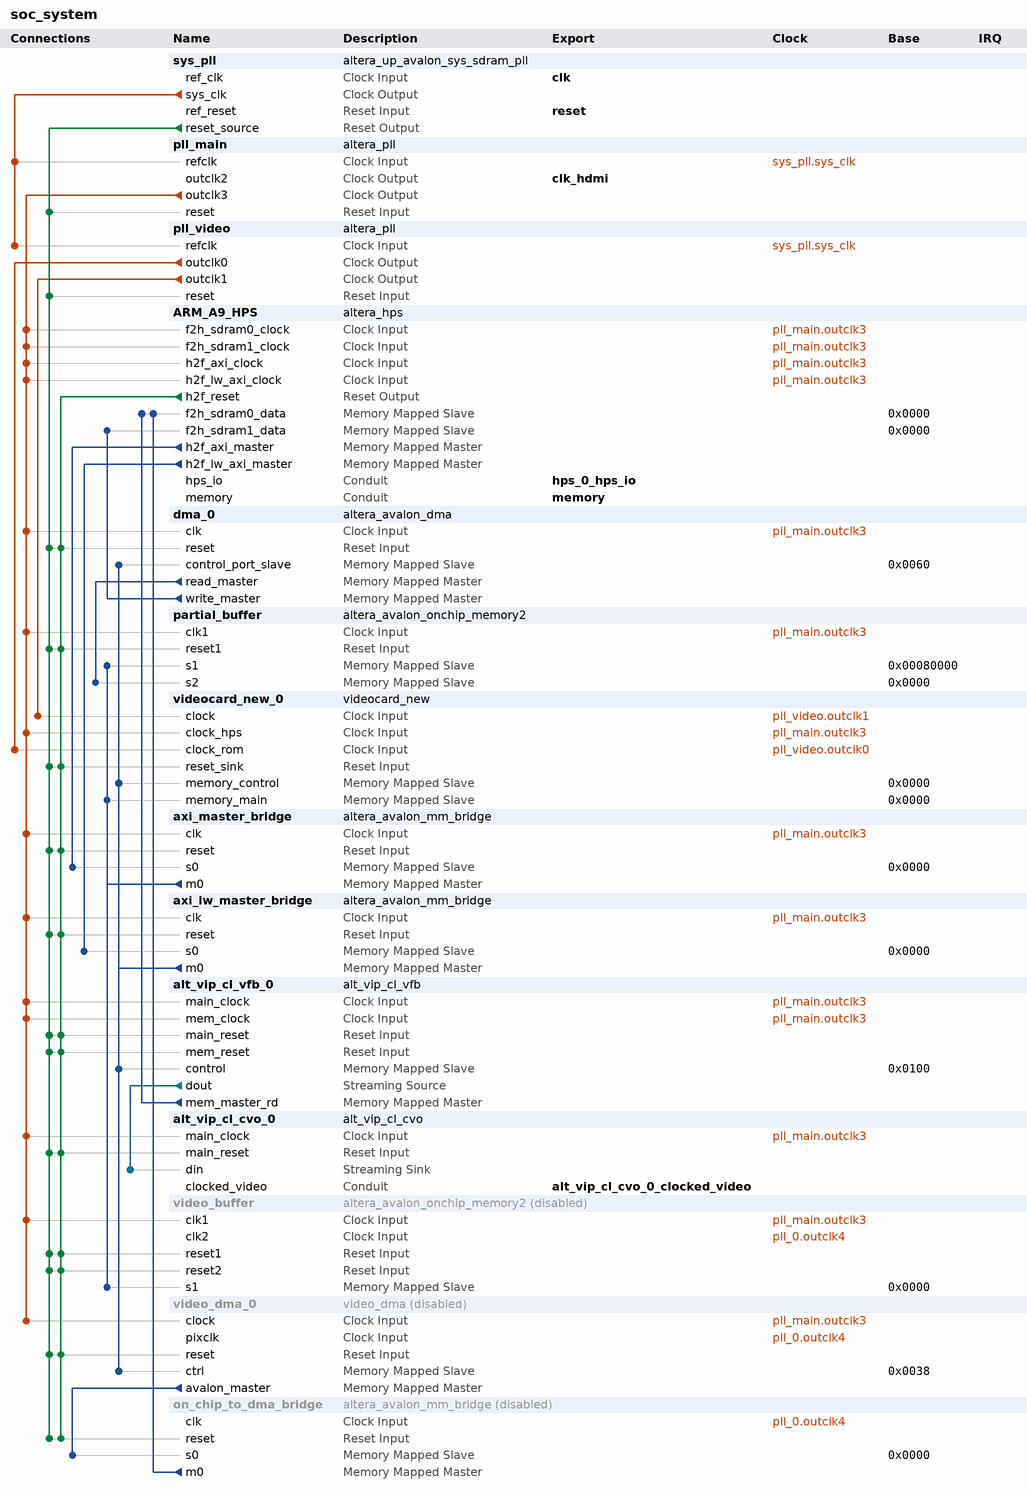
[diagram p0: system contents]
# Platform Designer (Qsys) system soc_system, Cyclone V 5CSEBA6U23I7
# Parameters at their usual value, and those the tool derives, are not listed.
package require -exact qsys 20.1
create_system soc_system
set_project_property DEVICE_FAMILY {Cyclone V}
set_project_property DEVICE 5CSEBA6U23I7

add_instance sys_pll altera_up_avalon_sys_sdram_pll 18.0
set_instance_parameter_value sys_pll CV_boards DE10-Nano
set_instance_parameter_value sys_pll gui_outclk 50.0
set_instance_parameter_value sys_pll gui_refclk 50.0

add_instance pll_main altera_pll 20.1
set_instance_parameter_value pll_main gui_device_speed_grade 1
set_instance_parameter_value pll_main gui_number_of_clocks 4
set_instance_parameter_value pll_main gui_operation_mode direct
set_instance_parameter_value pll_main gui_output_clock_frequency0 10.0
set_instance_parameter_value pll_main gui_output_clock_frequency1 5.0
set_instance_parameter_value pll_main gui_output_clock_frequency2 65.0
set_instance_parameter_value pll_main gui_output_clock_frequency3 100.0
set_instance_parameter_value pll_main gui_pll_mode {Integer-N PLL}
set_instance_parameter_value pll_main gui_reference_clock_frequency 50.0
set_instance_parameter_value pll_main gui_use_locked false

add_instance pll_video altera_pll 20.1
set_instance_parameter_value pll_video gui_device_speed_grade 1
set_instance_parameter_value pll_video gui_number_of_clocks 2
set_instance_parameter_value pll_video gui_operation_mode direct
set_instance_parameter_value pll_video gui_output_clock_frequency0 10.0
set_instance_parameter_value pll_video gui_output_clock_frequency1 1.0
set_instance_parameter_value pll_video gui_pll_mode {Integer-N PLL}
set_instance_parameter_value pll_video gui_reference_clock_frequency 50.0
set_instance_parameter_value pll_video gui_use_locked false

add_instance ARM_A9_HPS altera_hps 20.1
set_instance_parameter_value ARM_A9_HPS EMAC1_Mode RGMII
set_instance_parameter_value ARM_A9_HPS EMAC1_PinMuxing {HPS I/O Set 0}
set_instance_parameter_value ARM_A9_HPS F2SCLK_COLDRST_Enable false
set_instance_parameter_value ARM_A9_HPS F2SCLK_DBGRST_Enable false
set_instance_parameter_value ARM_A9_HPS F2SCLK_WARMRST_Enable false
set_instance_parameter_value ARM_A9_HPS F2SDRAM_Type {Avalon-MM Bidirectional,Avalon-MM Bidirectional}
set_instance_parameter_value ARM_A9_HPS F2SDRAM_Width 128,32
set_instance_parameter_value ARM_A9_HPS F2SINTERRUPT_Enable false
set_instance_parameter_value ARM_A9_HPS F2S_Width 0
set_instance_parameter_value ARM_A9_HPS FPGA_PERIPHERAL_OUTPUT_CLOCK_FREQ_EMAC0_GTX_CLK 100
set_instance_parameter_value ARM_A9_HPS FPGA_PERIPHERAL_OUTPUT_CLOCK_FREQ_EMAC0_MD_CLK 100.0
set_instance_parameter_value ARM_A9_HPS FPGA_PERIPHERAL_OUTPUT_CLOCK_FREQ_EMAC1_GTX_CLK 100
set_instance_parameter_value ARM_A9_HPS FPGA_PERIPHERAL_OUTPUT_CLOCK_FREQ_EMAC1_MD_CLK 100.0
set_instance_parameter_value ARM_A9_HPS HPS_PROTOCOL DDR3
set_instance_parameter_value ARM_A9_HPS I2C0_Mode I2C
set_instance_parameter_value ARM_A9_HPS I2C0_PinMuxing {HPS I/O Set 0}
set_instance_parameter_value ARM_A9_HPS I2C1_Mode I2C
set_instance_parameter_value ARM_A9_HPS I2C1_PinMuxing {HPS I/O Set 0}
set_instance_parameter_value ARM_A9_HPS LWH2F_Enable true
set_instance_parameter_value ARM_A9_HPS MEM_BANKADDR_WIDTH 3
set_instance_parameter_value ARM_A9_HPS MEM_CLK_FREQ 400.0
set_instance_parameter_value ARM_A9_HPS MEM_COL_ADDR_WIDTH 10
set_instance_parameter_value ARM_A9_HPS MEM_DQ_WIDTH 32
set_instance_parameter_value ARM_A9_HPS MEM_DRV_STR RZQ/6
set_instance_parameter_value ARM_A9_HPS MEM_ROW_ADDR_WIDTH 15
set_instance_parameter_value ARM_A9_HPS MEM_RTT_NOM RZQ/6
set_instance_parameter_value ARM_A9_HPS MEM_RTT_WR {Dynamic ODT off}
set_instance_parameter_value ARM_A9_HPS MEM_TCL 7
set_instance_parameter_value ARM_A9_HPS MEM_TFAW_NS 37.5
set_instance_parameter_value ARM_A9_HPS MEM_TRAS_NS 35.0
set_instance_parameter_value ARM_A9_HPS MEM_TRCD_NS 13.75
set_instance_parameter_value ARM_A9_HPS MEM_TRFC_NS 300.0
set_instance_parameter_value ARM_A9_HPS MEM_TRP_NS 13.75
set_instance_parameter_value ARM_A9_HPS MEM_VENDOR Other
set_instance_parameter_value ARM_A9_HPS MEM_WTCL 7
set_instance_parameter_value ARM_A9_HPS QSPI_Mode N/A
set_instance_parameter_value ARM_A9_HPS QSPI_PinMuxing Unused
set_instance_parameter_value ARM_A9_HPS REF_CLK_FREQ 25.0
set_instance_parameter_value ARM_A9_HPS S2FCLK_USER2CLK 4
set_instance_parameter_value ARM_A9_HPS S2F_Width 3
set_instance_parameter_value ARM_A9_HPS SDIO_Mode {4-bit Data}
set_instance_parameter_value ARM_A9_HPS SDIO_PinMuxing {HPS I/O Set 0}
set_instance_parameter_value ARM_A9_HPS SPIM1_Mode {Single Slave Select}
set_instance_parameter_value ARM_A9_HPS SPIM1_PinMuxing {HPS I/O Set 0}
set_instance_parameter_value ARM_A9_HPS STM_Enable false
set_instance_parameter_value ARM_A9_HPS TIMING_BOARD_AC_SKEW 0.02
set_instance_parameter_value ARM_A9_HPS TIMING_BOARD_AC_TO_CK_SKEW 0.0
set_instance_parameter_value ARM_A9_HPS TIMING_BOARD_DQ_TO_DQS_SKEW 0.0
set_instance_parameter_value ARM_A9_HPS TIMING_BOARD_MAX_CK_DELAY 0.6
set_instance_parameter_value ARM_A9_HPS TIMING_BOARD_MAX_DQS_DELAY 0.6
set_instance_parameter_value ARM_A9_HPS TIMING_BOARD_SKEW_BETWEEN_DQS 0.02
set_instance_parameter_value ARM_A9_HPS TIMING_BOARD_SKEW_CKDQS_DIMM_MAX 0.01
set_instance_parameter_value ARM_A9_HPS TIMING_BOARD_SKEW_CKDQS_DIMM_MIN -0.01
set_instance_parameter_value ARM_A9_HPS TIMING_BOARD_SKEW_WITHIN_DQS 0.02
set_instance_parameter_value ARM_A9_HPS TIMING_TDH 125
set_instance_parameter_value ARM_A9_HPS TIMING_TDQSCK 400
set_instance_parameter_value ARM_A9_HPS TIMING_TDQSQ 120
set_instance_parameter_value ARM_A9_HPS TIMING_TDS 50
set_instance_parameter_value ARM_A9_HPS TIMING_TIH 250
set_instance_parameter_value ARM_A9_HPS TIMING_TIS 175
set_instance_parameter_value ARM_A9_HPS TIMING_TQSH 0.38
set_instance_parameter_value ARM_A9_HPS UART0_Mode {No Flow Control}
set_instance_parameter_value ARM_A9_HPS UART0_PinMuxing {HPS I/O Set 0}
set_instance_parameter_value ARM_A9_HPS USB1_Mode SDR
set_instance_parameter_value ARM_A9_HPS USB1_PinMuxing {HPS I/O Set 0}
set_instance_parameter_value ARM_A9_HPS desired_cfg_clk_mhz 100.0
set_instance_parameter_value ARM_A9_HPS desired_qspi_clk_mhz 370.0

add_instance dma_0 altera_avalon_dma 20.1
set_instance_parameter_value dma_0 allowByteTransactions false
set_instance_parameter_value dma_0 allowDoubleWordTransactions false
set_instance_parameter_value dma_0 allowHalfWordTransactions false
set_instance_parameter_value dma_0 allowQuadWordTransactions false
set_instance_parameter_value dma_0 burstEnable false
set_instance_parameter_value dma_0 fifoDepth 32
set_instance_parameter_value dma_0 maxBurstSize 128
set_instance_parameter_value dma_0 minimumDmaTransactionRegisterWidth 13

add_instance partial_buffer altera_avalon_onchip_memory2 20.1
set_instance_parameter_value partial_buffer dataWidth 32
set_instance_parameter_value partial_buffer dualPort true
set_instance_parameter_value partial_buffer initMemContent true
set_instance_parameter_value partial_buffer initializationFileName onchip_mem.hex
set_instance_parameter_value partial_buffer memorySize 4096
set_instance_parameter_value partial_buffer singleClockOperation true

add_instance videocard_new_0 videocard_new 1.0
set_instance_parameter_value videocard_new_0 BYTES 4
set_instance_parameter_value videocard_new_0 WIDTH 32
set_instance_parameter_value videocard_new_0 WIDTH_CTRL 8

add_instance axi_master_bridge altera_avalon_mm_bridge 20.1
set_instance_parameter_value axi_master_bridge ADDRESS_UNITS SYMBOLS
set_instance_parameter_value axi_master_bridge ADDRESS_WIDTH 10
set_instance_parameter_value axi_master_bridge DATA_WIDTH 32
set_instance_parameter_value axi_master_bridge MAX_PENDING_RESPONSES 4
set_instance_parameter_value axi_master_bridge USE_AUTO_ADDRESS_WIDTH 1

add_instance axi_lw_master_bridge altera_avalon_mm_bridge 20.1
set_instance_parameter_value axi_lw_master_bridge ADDRESS_UNITS SYMBOLS
set_instance_parameter_value axi_lw_master_bridge ADDRESS_WIDTH 10
set_instance_parameter_value axi_lw_master_bridge DATA_WIDTH 32
set_instance_parameter_value axi_lw_master_bridge MAX_PENDING_RESPONSES 4
set_instance_parameter_value axi_lw_master_bridge USE_AUTO_ADDRESS_WIDTH 1

add_instance alt_vip_cl_vfb_0 alt_vip_cl_vfb 20.1
set_instance_parameter_value alt_vip_cl_vfb_0 CLOCKS_ARE_SEPARATE 1
set_instance_parameter_value alt_vip_cl_vfb_0 DROP_FRAMES 1
set_instance_parameter_value alt_vip_cl_vfb_0 DROP_INVALID_FIELDS 1
set_instance_parameter_value alt_vip_cl_vfb_0 DROP_REPEAT_USER 0
set_instance_parameter_value alt_vip_cl_vfb_0 IS_FRAME_READER 1
set_instance_parameter_value alt_vip_cl_vfb_0 LINE_BASED_BUFFERING 0
set_instance_parameter_value alt_vip_cl_vfb_0 MAX_HEIGHT 768
set_instance_parameter_value alt_vip_cl_vfb_0 MAX_WIDTH 1024
set_instance_parameter_value alt_vip_cl_vfb_0 MEM_BASE_ADDR 536870912
set_instance_parameter_value alt_vip_cl_vfb_0 MEM_BUFFER_OFFSET 16777216
set_instance_parameter_value alt_vip_cl_vfb_0 MEM_PORT_WIDTH 128
set_instance_parameter_value alt_vip_cl_vfb_0 NUMBER_OF_COLOR_PLANES 4
set_instance_parameter_value alt_vip_cl_vfb_0 PRIORITIZE_FMAX 0
set_instance_parameter_value alt_vip_cl_vfb_0 READER_RUNTIME_CONTROL 1
set_instance_parameter_value alt_vip_cl_vfb_0 READ_FIFO_DEPTH 512
set_instance_parameter_value alt_vip_cl_vfb_0 USER_PACKETS_MAX_STORAGE 1
set_instance_parameter_value alt_vip_cl_vfb_0 USE_BUFFER_OFFSET 0
set_instance_parameter_value alt_vip_cl_vfb_0 WRITE_BURST_TARGET 32
set_instance_parameter_value alt_vip_cl_vfb_0 WRITE_FIFO_DEPTH 512

add_instance alt_vip_cl_cvo_0 alt_vip_cl_cvo 20.1
set_instance_parameter_value alt_vip_cl_cvo_0 ACCEPT_COLOURS_IN_SEQ 0
set_instance_parameter_value alt_vip_cl_cvo_0 ACCEPT_SYNC 0
set_instance_parameter_value alt_vip_cl_cvo_0 ANC_LINE 0
set_instance_parameter_value alt_vip_cl_cvo_0 AP_LINE 0
set_instance_parameter_value alt_vip_cl_cvo_0 BPS 8
set_instance_parameter_value alt_vip_cl_cvo_0 CLOCKS_ARE_SAME 0
set_instance_parameter_value alt_vip_cl_cvo_0 COLOUR_PLANES_ARE_IN_PARALLEL 1
set_instance_parameter_value alt_vip_cl_cvo_0 CONTEXT_WIDTH 8
set_instance_parameter_value alt_vip_cl_cvo_0 COUNT_STEP_IS_PIP_VALUE 0
set_instance_parameter_value alt_vip_cl_cvo_0 DST_WIDTH 8
set_instance_parameter_value alt_vip_cl_cvo_0 FIELD0_ANC_LINE 0
set_instance_parameter_value alt_vip_cl_cvo_0 FIELD0_V_BACK_PORCH 0
set_instance_parameter_value alt_vip_cl_cvo_0 FIELD0_V_BLANK 0
set_instance_parameter_value alt_vip_cl_cvo_0 FIELD0_V_FRONT_PORCH 0
set_instance_parameter_value alt_vip_cl_cvo_0 FIELD0_V_RISING_EDGE 0
set_instance_parameter_value alt_vip_cl_cvo_0 FIELD0_V_SYNC_LENGTH 0
set_instance_parameter_value alt_vip_cl_cvo_0 FIFO_DEPTH 4000
set_instance_parameter_value alt_vip_cl_cvo_0 F_FALLING_EDGE 0
set_instance_parameter_value alt_vip_cl_cvo_0 F_RISING_EDGE 0
set_instance_parameter_value alt_vip_cl_cvo_0 GENERATE_SYNC 0
set_instance_parameter_value alt_vip_cl_cvo_0 H_ACTIVE_PIXELS 1024
set_instance_parameter_value alt_vip_cl_cvo_0 H_BACK_PORCH 160
set_instance_parameter_value alt_vip_cl_cvo_0 H_BLANK 0
set_instance_parameter_value alt_vip_cl_cvo_0 H_FRONT_PORCH 24
set_instance_parameter_value alt_vip_cl_cvo_0 H_SYNC_LENGTH 136
set_instance_parameter_value alt_vip_cl_cvo_0 INTERLACED 0
set_instance_parameter_value alt_vip_cl_cvo_0 LOW_LATENCY 0
set_instance_parameter_value alt_vip_cl_cvo_0 NO_OF_CHANNELS 1
set_instance_parameter_value alt_vip_cl_cvo_0 NO_OF_MODES 1
set_instance_parameter_value alt_vip_cl_cvo_0 NUMBER_OF_COLOUR_PLANES 4
set_instance_parameter_value alt_vip_cl_cvo_0 PIXELS_IN_PARALLEL 1
set_instance_parameter_value alt_vip_cl_cvo_0 SRC_WIDTH 8
set_instance_parameter_value alt_vip_cl_cvo_0 STD_WIDTH 1
set_instance_parameter_value alt_vip_cl_cvo_0 TASK_WIDTH 8
set_instance_parameter_value alt_vip_cl_cvo_0 THRESHOLD 3999
set_instance_parameter_value alt_vip_cl_cvo_0 USE_CONTROL 0
set_instance_parameter_value alt_vip_cl_cvo_0 USE_EMBEDDED_SYNCS 0
set_instance_parameter_value alt_vip_cl_cvo_0 V_ACTIVE_LINES 768
set_instance_parameter_value alt_vip_cl_cvo_0 V_BACK_PORCH 29
set_instance_parameter_value alt_vip_cl_cvo_0 V_BLANK 0
set_instance_parameter_value alt_vip_cl_cvo_0 V_FRONT_PORCH 3
set_instance_parameter_value alt_vip_cl_cvo_0 V_SYNC_LENGTH 6

add_instance video_buffer altera_avalon_onchip_memory2 20.1
set_instance_property video_buffer ENABLED false
set_instance_parameter_value video_buffer dataWidth 32
set_instance_parameter_value video_buffer dualPort true
set_instance_parameter_value video_buffer initMemContent true
set_instance_parameter_value video_buffer initializationFileName onchip_mem.hex
set_instance_parameter_value video_buffer memorySize 24576

add_instance video_dma_0 video_dma 1.0
set_instance_property video_dma_0 ENABLED false
set_instance_parameter_value video_dma_0 VIDEO_H 768
set_instance_parameter_value video_dma_0 VIDEO_W 1024

add_instance on_chip_to_dma_bridge altera_avalon_mm_bridge 20.1
set_instance_property on_chip_to_dma_bridge ENABLED false
set_instance_parameter_value on_chip_to_dma_bridge ADDRESS_UNITS SYMBOLS
set_instance_parameter_value on_chip_to_dma_bridge ADDRESS_WIDTH 10
set_instance_parameter_value on_chip_to_dma_bridge DATA_WIDTH 32
set_instance_parameter_value on_chip_to_dma_bridge MAX_PENDING_RESPONSES 4
set_instance_parameter_value on_chip_to_dma_bridge USE_AUTO_ADDRESS_WIDTH 1

# connections
add_connection pll_0.outclk4 on_chip_to_dma_bridge.clk clock
add_connection pll_0.outclk4 video_buffer.clk2 clock
add_connection pll_0.outclk4 video_dma_0.pixclk clock
add_connection pll_main.outclk3 alt_vip_cl_cvo_0.main_clock clock
add_connection pll_main.outclk3 alt_vip_cl_vfb_0.main_clock clock
add_connection pll_main.outclk3 alt_vip_cl_vfb_0.mem_clock clock
add_connection pll_main.outclk3 ARM_A9_HPS.f2h_sdram0_clock clock
add_connection pll_main.outclk3 ARM_A9_HPS.f2h_sdram1_clock clock
add_connection pll_main.outclk3 ARM_A9_HPS.h2f_axi_clock clock
add_connection pll_main.outclk3 ARM_A9_HPS.h2f_lw_axi_clock clock
add_connection pll_main.outclk3 axi_lw_master_bridge.clk clock
add_connection pll_main.outclk3 axi_master_bridge.clk clock
add_connection pll_main.outclk3 dma_0.clk clock
add_connection pll_main.outclk3 partial_buffer.clk1 clock
add_connection pll_main.outclk3 video_buffer.clk1 clock
add_connection pll_main.outclk3 video_dma_0.clock clock
add_connection pll_main.outclk3 videocard_new_0.clock_hps clock
add_connection pll_video.outclk0 videocard_new_0.clock_rom clock
add_connection pll_video.outclk1 videocard_new_0.clock clock
add_connection sys_pll.sys_clk pll_main.refclk clock
add_connection sys_pll.sys_clk pll_video.refclk clock
add_connection ARM_A9_HPS.h2f_reset alt_vip_cl_cvo_0.main_reset reset
add_connection ARM_A9_HPS.h2f_reset alt_vip_cl_vfb_0.main_reset reset
add_connection ARM_A9_HPS.h2f_reset alt_vip_cl_vfb_0.mem_reset reset
add_connection ARM_A9_HPS.h2f_reset axi_lw_master_bridge.reset reset
add_connection ARM_A9_HPS.h2f_reset axi_master_bridge.reset reset
add_connection ARM_A9_HPS.h2f_reset dma_0.reset reset
add_connection ARM_A9_HPS.h2f_reset on_chip_to_dma_bridge.reset reset
add_connection ARM_A9_HPS.h2f_reset partial_buffer.reset1 reset
add_connection ARM_A9_HPS.h2f_reset video_buffer.reset1 reset
add_connection ARM_A9_HPS.h2f_reset video_buffer.reset2 reset
add_connection ARM_A9_HPS.h2f_reset video_dma_0.reset reset
add_connection ARM_A9_HPS.h2f_reset videocard_new_0.reset_sink reset
add_connection sys_pll.reset_source alt_vip_cl_cvo_0.main_reset reset
add_connection sys_pll.reset_source alt_vip_cl_vfb_0.main_reset reset
add_connection sys_pll.reset_source alt_vip_cl_vfb_0.mem_reset reset
add_connection sys_pll.reset_source axi_lw_master_bridge.reset reset
add_connection sys_pll.reset_source axi_master_bridge.reset reset
add_connection sys_pll.reset_source dma_0.reset reset
add_connection sys_pll.reset_source on_chip_to_dma_bridge.reset reset
add_connection sys_pll.reset_source partial_buffer.reset1 reset
add_connection sys_pll.reset_source pll_main.reset reset
add_connection sys_pll.reset_source pll_video.reset reset
add_connection sys_pll.reset_source video_buffer.reset1 reset
add_connection sys_pll.reset_source video_buffer.reset2 reset
add_connection sys_pll.reset_source video_dma_0.reset reset
add_connection sys_pll.reset_source videocard_new_0.reset_sink reset
add_connection alt_vip_cl_vfb_0.mem_master_rd ARM_A9_HPS.f2h_sdram0_data avalon
set_connection_parameter_value alt_vip_cl_vfb_0.mem_master_rd/ARM_A9_HPS.f2h_sdram0_data baseAddress 0x0000
add_connection ARM_A9_HPS.h2f_axi_master axi_master_bridge.s0 avalon
set_connection_parameter_value ARM_A9_HPS.h2f_axi_master/axi_master_bridge.s0 baseAddress 0x0000
add_connection ARM_A9_HPS.h2f_lw_axi_master axi_lw_master_bridge.s0 avalon
set_connection_parameter_value ARM_A9_HPS.h2f_lw_axi_master/axi_lw_master_bridge.s0 baseAddress 0x0000
add_connection axi_lw_master_bridge.m0 alt_vip_cl_vfb_0.control avalon
set_connection_parameter_value axi_lw_master_bridge.m0/alt_vip_cl_vfb_0.control baseAddress 0x0100
add_connection axi_lw_master_bridge.m0 dma_0.control_port_slave avalon
set_connection_parameter_value axi_lw_master_bridge.m0/dma_0.control_port_slave baseAddress 0x0060
add_connection axi_lw_master_bridge.m0 video_dma_0.ctrl avalon
set_connection_parameter_value axi_lw_master_bridge.m0/video_dma_0.ctrl baseAddress 0x0038
add_connection axi_lw_master_bridge.m0 videocard_new_0.memory_control avalon
set_connection_parameter_value axi_lw_master_bridge.m0/videocard_new_0.memory_control baseAddress 0x0000
add_connection axi_master_bridge.m0 partial_buffer.s1 avalon
set_connection_parameter_value axi_master_bridge.m0/partial_buffer.s1 baseAddress 0x00080000
add_connection axi_master_bridge.m0 video_buffer.s1 avalon
set_connection_parameter_value axi_master_bridge.m0/video_buffer.s1 baseAddress 0x0000
add_connection axi_master_bridge.m0 videocard_new_0.memory_main avalon
set_connection_parameter_value axi_master_bridge.m0/videocard_new_0.memory_main baseAddress 0x0000
add_connection dma_0.read_master partial_buffer.s2 avalon
set_connection_parameter_value dma_0.read_master/partial_buffer.s2 baseAddress 0x0000
add_connection dma_0.write_master ARM_A9_HPS.f2h_sdram1_data avalon
set_connection_parameter_value dma_0.write_master/ARM_A9_HPS.f2h_sdram1_data baseAddress 0x0000
add_connection on_chip_to_dma_bridge.m0 ARM_A9_HPS.f2h_sdram0_data avalon
set_connection_parameter_value on_chip_to_dma_bridge.m0/ARM_A9_HPS.f2h_sdram0_data baseAddress 0x0000
add_connection video_dma_0.avalon_master on_chip_to_dma_bridge.s0 avalon
set_connection_parameter_value video_dma_0.avalon_master/on_chip_to_dma_bridge.s0 baseAddress 0x0000
add_connection alt_vip_cl_vfb_0.dout alt_vip_cl_cvo_0.din avalon_streaming

# exported interfaces
add_interface alt_vip_cl_cvo_0_clocked_video conduit end
set_interface_property alt_vip_cl_cvo_0_clocked_video EXPORT_OF alt_vip_cl_cvo_0.clocked_video
add_interface clk clock sink
set_interface_property clk EXPORT_OF sys_pll.ref_clk
add_interface clk_hdmi clock source
set_interface_property clk_hdmi EXPORT_OF pll_main.outclk2
add_interface hps_0_hps_io conduit end
set_interface_property hps_0_hps_io EXPORT_OF ARM_A9_HPS.hps_io
add_interface memory conduit end
set_interface_property memory EXPORT_OF ARM_A9_HPS.memory
add_interface reset reset sink
set_interface_property reset EXPORT_OF sys_pll.ref_reset

set_interconnect_requirement {$system} qsys_mm.clockCrossingAdapter HANDSHAKE
set_interconnect_requirement {$system} qsys_mm.maxAdditionalLatency 1

save_system soc_system.qsys
